# Altium schematic sheet Actuators.SchDoc: Actuators
size A3; SheetNumber: 6; SheetTotal: 10
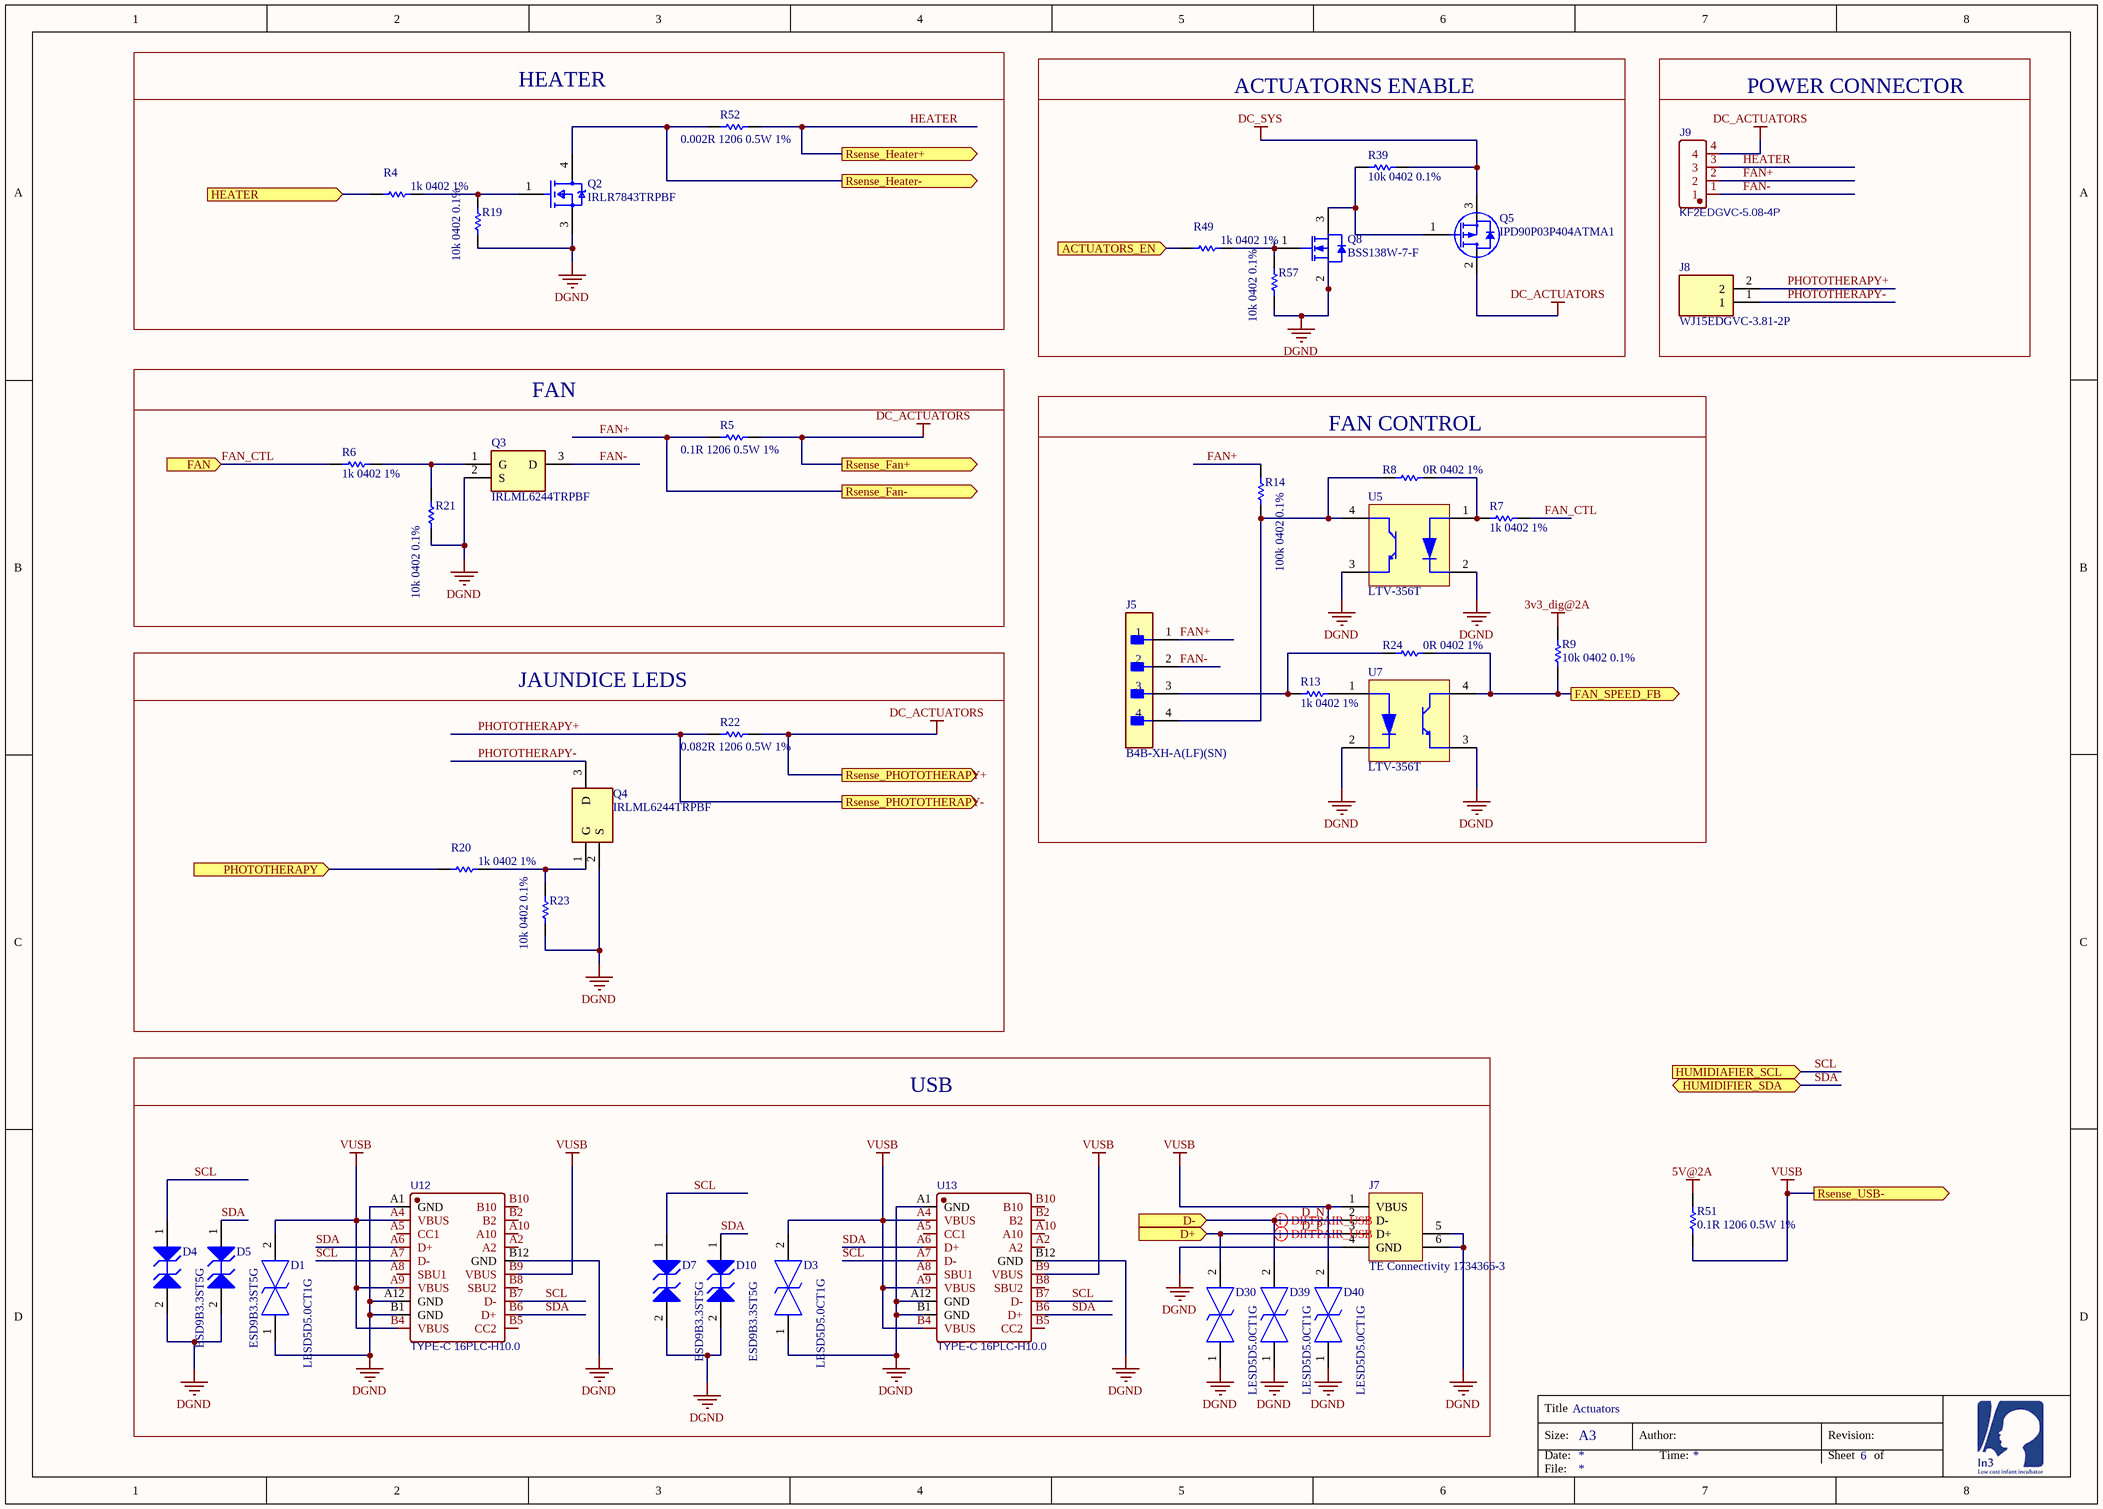
[diagram p0: Actuators.SchDoc]

## Parts
D1  LESD5D5.0CT1G  [LESD5D50CT1G]
D3  LESD5D5.0CT1G  [LESD5D50CT1G]
D4  ESD9B3.3ST5G  [ONSC-SOD-923-2-514AB-01_V]
D5  ESD9B3.3ST5G  [ONSC-SOD-923-2-514AB-01_V]
D7  ESD9B3.3ST5G  [ONSC-SOD-923-2-514AB-01_V]
D10  ESD9B3.3ST5G  [ONSC-SOD-923-2-514AB-01_V]
D30  LESD5D5.0CT1G  [LESD5D50CT1G]
D39  LESD5D5.0CT1G  [LESD5D50CT1G]
D40  LESD5D5.0CT1G  [LESD5D50CT1G]
J5  B4B-XH-A(LF)(SN)  [FP-B4B-XH-A_LF_SN-MFG]
J7  TE Connectivity 1734366-3  [PCB-wbedblczgi94a8su0lrn-1]
J8  WJ15EDGVC-3.81-2P  [SHDR2W85P0X381_1X2_850X700X935P]
J9  KF2EDGVC-5.08-4P  [CONN-TH_4P-P5.08_KF2EDGVC-5.08-4P]
Q2  IRLR7843TRPBF  [FP-PG-TO252-3-MFG]
Q3  IRLML6244TRPBF  [SOT95P237X112-3N]
Q4  IRLML6244TRPBF  [SOT95P237X112-3N]
Q5  IPD90P03P404ATMA1  [DPAK IPD90P03P404ATMA1]
Q8  BSS138W-7-F  [DIOD-SOT323-3_V]
R4  1k 0402 1%  [RESC1005X40X25ML05T10]
R5  0.1R 1206 0.5W 1%  [CAPC3216X180X55ML20T25]
R6  1k 0402 1%  [RESC1005X40X25ML05T10]
R7  1k 0402 1%  [RESC1005X40X25ML05T10]
R8  0R 0402 1%  [RESC1005X40X25ML05T10]
R9  10k 0402 0.1%  [RESC1005X40X25ML05T10]
R13  1k 0402 1%  [RESC1005X40X25ML05T10]
R14  100k 0402 0.1%  [RESC1005X40X25ML05T10]
R19  10k 0402 0.1%  [RESC1005X40X25ML05T10]
R20  1k 0402 1%  [RESC1005X40X25ML05T10]
R21  10k 0402 0.1%  [RESC1005X40X25ML05T10]
R22  0.082R 1206 0.5W 1%  [CAPC3216X180X55ML20T25]
R23  10k 0402 0.1%  [RESC1005X40X25ML05T10]
R24  0R 0402 1%  [RESC1005X40X25ML05T10]
R39  10k 0402 0.1%  [RESC1005X40X25ML05T10]
R49  1k 0402 1%  [RESC1005X40X25ML05T10]
R51  0.1R 1206 0.5W 1%  [CAPC3216X180X55ML20T25]
R52  0.002R 1206 0.5W 1%  [CAPC3216X180X55ML20T25]
R57  10k 0402 0.1%  [RESC1005X40X25ML05T10]
U5  LTV-356T  [LTST-LTV-356T-4_V]
U7  LTV-356T  [LTST-LTV-356T-4_V]
U12  TYPE-C 16PLC-H10.0  [TYPE-C-TH_16PLC-H10.0]
U13  TYPE-C 16PLC-H10.0  [TYPE-C-TH_16PLC-H10.0]

## Blocks framed on the sheet
HEATER: Q2 R4 R19 R52
ACTUATORNS ENABLE: Q5 Q8 R39 R49 R57
POWER CONNECTOR: J8 J9
FAN: Q3 R5 R6 R21
FAN CONTROL: J5 R7-R9 R13 R14 R24 U5 U7
JAUNDICE LEDS: Q4 R20 R22 R23
USB: D1 D3-D5 D7 D10 D30 D39 D40 J7 U12 U13

## Ports
ACTUATORS_EN (in), D+ (in), D- (in), FAN (in), FAN_SPEED_FB (out), HEATER (in), HUMIDIAFIER_SCL (in), HUMIDIFIER_SDA (bidir), PHOTOTHERAPY (in), Rsense_Fan+ (out), Rsense_Fan- (out), Rsense_Heater+ (out), Rsense_Heater- (out), Rsense_PHOTOTHERAPY+ (out), Rsense_PHOTOTHERAPY- (out), Rsense_USB- (out)

## Nets
3v3_dig@2A: R9.2
5V@2A: R51.1
DC_ACTUATORS: J9.4 Q5.2(D) R5.1 R22.1 ; port Rsense_PHOTOTHERAPY+, port Rsense_Fan+
DC_SYS: Q5.3(S) R39.1
DGND: D1.1 D3.1 D4.2(A2) D5.2(A2) D7.2(A2) D10.2(A2) D30.1 D39.1 D40.1 J7.4(GND) J7.5(SHIELD) J7.6(SHIELD) Q2.3(SOURCE) Q3.2(S) Q4.2(S) Q8.2(S) R19.1 R21.1 R23.1 R57.1 U5.2(CATHODE) U5.3(EMITTER) U7.2(CATHODE) U7.3(EMITTER) U12.A1(GND) U12.A12(GND) U12.B1(GND) U12.B12(GND) U13.A1(GND) U13.A12(GND) U13.B1(GND) U13.B12(GND)
VUSB: D1.2 D3.2 D40.2 J7.1(VBUS) R51.2 U12.A4(VBUS) U12.A9(VBUS) U12.B4(VBUS) U12.B9(VBUS) U13.A4(VBUS) U13.A9(VBUS) U13.B4(VBUS) U13.B9(VBUS) ; port Rsense_USB-
ACTUATORS_EN: R49.2 ; port ACTUATORS_EN
D_N: D39.2 J7.2(D-) ; port D-
D_P: D30.2 J7.3(D+) ; port D+
FAN+: J5.1 J9.2 R5.2 R14.2 ; port Rsense_Fan-
FAN-: J5.2 J9.1 Q3.3(D)
FAN_CTL: R6.2 R7.2 ; port FAN
FAN_SPEED_FB: R9.1 R24.1 U7.4(COLLECTOR) ; port FAN_SPEED_FB
HEATER: J9.3 R52.1 ; port Rsense_Heater+
HEATER: R4.2 ; port HEATER  [a separate net that carries the same name]
PHOTOTHERAPY: R20.2 ; port PHOTOTHERAPY
PHOTOTHERAPY+: J8.2 R22.2 ; port Rsense_PHOTOTHERAPY-
PHOTOTHERAPY-: J8.1 Q4.3(D)
Rsense_Heater-: Q2.4(DRAIN) R52.2 ; port Rsense_Heater-
SCL: D4.1(A1) D7.1(A1) U12.A7(D-) U12.B7(D-) U13.A7(D-) U13.B7(D-) ; port HUMIDIAFIER_SCL
SDA: D5.1(A1) D10.1(A1) U12.A6(D+) U12.B6(D+) U13.A6(D+) U13.B6(D+) ; port HUMIDIFIER_SDA
NetJ5_3: J5.3 R13.1 R24.2
NetJ5_4: J5.4 R8.2 R14.1 U5.4(COLLECTOR)
NetQ2_1: Q2.1(GATE) R4.1 R19.2
NetQ3_1: Q3.1(G) R6.1 R21.2
NetQ4_1: Q4.1(G) R20.1 R23.2
NetQ5_1: Q5.1(G) Q8.3(D) R39.2
NetQ8_1: Q8.1(G) R49.1 R57.2
NetR7_1: R7.1 R8.1 U5.1(ANODE)
NetR13_2: R13.2 U7.1(ANODE)

Not connected (* = marked no-connect by the designer): U12 A2 A5(CC1) A8(SBU1) A10 B2 B5(CC2) B8(SBU2) B10; U13 A2 A5(CC1) A8(SBU1) A10 B2 B5(CC2) B8(SBU2) B10

## Layout directives
differential pair; differential pair class USB: D_N, D_P

## Notes on the sheet
- Title
- Size:
- Date:
- A3
- Author:
- Time:
- Revision:
- Sheet
- of
- File:

## Library data of the parts
D1 D3 D30 D39 D40 = LESD5D5.0CT1G: TVS Diode (Bi-directional); Manufacturer_Name: LRC; Height: 0.7mm; Manufacturer_Part_Number: LESD5D5.0CT1G; LCSC_PN: C383211
D4 D5 D7 D10 = CMP-1063-00120-1: Transient Voltage Suppressor, Micro-Packaged Diode for ESD Protection, 2-Pin SOD-923, Pb-Free, Tape and Reel; Manufacturer: On Semiconductor; Number of Lines: 1; V(BR) Min (V): 5; VRWM Max (V): 3.3; Direction: Bidirectional; ComponentLink3URL: http://www.onsemi.com/pub_link/Collateral/514AB.PDF; PartNumber: ESD9B3.3ST5G; PackageVersion: Rev. C, 03/2011; Mounting Technology: Surface Mount; PackageReference: SOD-923-2-514AB-01; RoHS: Pb-Free; DatasheetVersion: Rev. 2; ComponentLink1URL: http://www.onsemi.com/; PackageDescription: 2-Pin SOD, Body 0.8 x 0.6 mm; ComponentLink3Description: Package Specification; ComponentLink2URL: http://www.onsemi.cn/pub_link/Collateral/ESD9B-D.PDF; IR Max (uA): 1; Packing: Tape and Reel; ComponentLink2Description: Datasheet; ComponentLink1Description: Manufacturer URL; LCSC_PN: C96512
J5 = CMP-17439-000250-1: CONN HEADER VERT 4POS 2.5MM; Number of Contacts: 4; Contact Resistance: 20mR; Voltage Rating: 250V; Max Current Rating: 3A; Gender: Male; Wire/Cable Gauge: 22AWG; Mated Stacking Heights: 9.8mm; Insulation Resistance: 1GR; Orientation: Straight; Contact Type: Male Pin; Contact Finish - Mating: TIN; Series: XH; Max Voltage Rating (AC): 250V; Lead Pitch: 2.5mm; Contact Shape: Square; Insulation Color: Natural; Termination: Solder; Lead Free: Lead Free; Voltage Rating (AC): 250V; Number of Rows: 1; Flammability Rating: UL94 V-0; Number of Positions: 4; Max Operating Temperature: 85°C; Package Quantity: 500; Mount: Through Hole; REACH SVHC: No SVHC; Connector Type: Header; Insulation Material: Nylon; Fastening Type: Detent; Min Operating Temperature: -25°C; Housing Color: White; Packaging: Bulk; Contact Plating: Tin; Contact Material: Brass; Max Voltage Rating (DC): 250V; Housing Material: Polyamide; Color: Natural; Material: Polyamide; Pitch: 2.5mm; Depth: 5.75mm; Current Rating: 3A; Length: 12.4mm; LCSC_PN: C144395
J7 = CMP-27c8ec666f97f80f-1: Conn USB 2.0 Type A RCP 4 POS Solder ST Thru-Hole 4 Terminal 1 Port Tray; Gender: Female; Lead-Free Status: Lead Free; ELV Compliant: Compliant; Housing Color: Blue; Octopart URL: http://octopart.com/1734366-3-te+connectivity-44330297; Manufacturer Part Number: 1734366-3; Packaging: Tray; Lifecycle Status: Active; RoHS: Compliant; Housing Material: Thermoplastic; Contact Plating: Gold Flash, Gold Flash over Nickel; OctopartID: 27c8ec666f97f80f; LCSC Part: C32896; LCSC_PN: C32896
J8 = WJ15EDGVC-3.81-2P: Connector; Manufacturer_Name: Ningbo Kangnex; Datasheet Link: https://datasheet.lcsc.com/szlcsc/Ningbo-Kangnex-Elec-WJ15EDGVC-3-81-2P_C8396.pdf; Height: 9.35mm; Manufacturer_Part_Number: WJ15EDGVC-3.81-2P; LCSC_PN: C8396
J9 = KF2EDGVC-5.08-4P: BOM_Manufacturer: Cixi Kefa Elec; Contributor: LCSC; BOM_Supplier: LCSC; BOM_Supplier Part: C441388; BOM_Manufacturer Part: KF2EDGVC-5.08-4P; BOM_JLCPCB Part Class: Extended Part; spicePre: C; spiceSymbolName: KF2EDGVC-5.08-4P; LCSC_PN: C441388
Q2 = CMP-32901-000143-1: MOSFET N-CH 30V 161A DPAK; Manufacturer: Infineon; Drain To Source Resistance: 3.2mΩ; Depletion Mode: False; Reverse Recovery Time: 39ns; Reverse Recovery Charge: 36nC; Threshold Vgs Max: 2.3V; Rthja Max: 50°C/W; Threshold Vgs Min: 1.4V; Power Dissipation: 140W; Pulse Drain Current: 620A; Input Capacitace At Vds: 4380pF @ 15V; Turn On Delay Time: 25ns; Gate To Source Voltage: 20V; Max Forward Diode Voltage: 1V; Gate Charge At Vgs: 34nC @ 4.5V; Max Junction Temp: +175°C; Number Of Channels: 1; Turn Off Delay Time: 34ns; ComponentLink2URL: https://www.infineon.com/dgdl/irlr7843pbf.pdf?fileId=5546d462533600a40153566de53526d8; Temperature Range High: +175°C; Octopart: https://octopart.com/irlr7843trpbf-infineon-65875062; Temperature: -55°C to +175°C; Device Class L3: MOSFETs; Manufacturer Part Number: IRLR7843TRPBF; Category: Trans; Package: PG-TO252-3; Footprint Url: https://www.infineon.com/cms/en/product/packages/PG-TO252/PG-TO252-3-901/; Continuous Drain Current: 161A; Digikey Description: MOSFET N-CH 30V 161A DPAK; Automotive: No; Lead Free: Yes; Drain To Source Breakdown Voltage: 30V; Height: 2.52mm; Temperature Range Low: -55°C; RoHS: TRUE; Number Of N Channels: 1; Drain To Source Voltage: 30V; ComponentLink2Description: Datasheet; Device Class L2: Transistors; Device Class L1: Discrete Semiconductors; LCSC_PN: C21988
Q3 Q4 = IRLML6244TRPBF: Transistor; Manufacturer_Name: Infineon; Datasheet Link: http://www.infineon.com/dgdl/irlml6244pbf.pdf?fileId=5546d462533600a4015356686fed261f; Height: 1.12mm; Manufacturer_Part_Number: IRLML6244TRPBF; Mouser Part Number: 942-IRLML6244TRPBF; Mouser Price/Stock: https://www.mouser.co.uk/ProductDetail/Infineon-IR/IRLML6244TRPBF?qs=9%252BKlkBgLFf1HkY%2F2U%252BIhLQ%3D%3D; Arrow Part Number: IRLML6244TRPBF; Arrow Price/Stock: https://www.arrow.com/en/products/irlml6244trpbf/infineon-technologies-ag?region=nac; LCSC_PN: C143946
Q5 = CMP-3103264-6: Single P-Channel 30 V 4.5 mOhm 100 nC OptiMOS Power Mosfet - TO-252-3-11; Lead-Free Status: Lead Free; REACH SVHC Compliance: No SVHC; Octopart URL: https://octopart.com/ipd90p03p404atma1-infineon-21386769; Polarity: P-Channel; RoHS: Compliant; Mounting Style: Surface Mount; Operating Temperature: 175 °C (max); Packaging: Reel; Number of Pins: 3; OctopartID: f6ad3ee185da296a; Manufacturer Part Number: IPD90P03P404ATMA1; Manufacturer Part Number 2: WSF70P03; LCSC_PN: C148439
Q8 = CMP-2000-05968-1: N-Channel Enhancement Mode Mosfet, 50 V, 200 mA, -55 to 150 degC, 6-Pin SOT-323, RoHS, Tape and Reel; Typical Turn-Off Delay Time: 20ns; Number of Channels: 1Channel; Type: EnhancementModeFieldEffectTransistor; Brand: DiodesIncorporated; Vds - Drain-Source Breakdown Voltage: 75V; Vgs - Gate-Source Voltage: 20V; Rds On - Drain-Source Resistance: 1.4Ohms; Transistor Type: 1N-Channel; Configuration: Single; Unit Weight: 0.000212oz; Pd - Power Dissipation: 200mW; Id - Continuous Drain Current: 200mA; Forward Transconductance - Min: 0.1S; Manufacturer URL: http://www.diodes.com/; Series: BSS138; Package Description: 3-Pin Small Outline Transistor, Body 2 x 1.25 mm, Pitch 0.65 mm; Mounting Technology: SurfaceMount; Product Category: MOSFET; RoHS: True; Maximum Operating Temperature: +150C; Height: 1mm; Length: 2.2mm; Technology: Si; Width: 1.35mm; Datasheet URL: http://www.diodes.com/_files/datasheets/ds30206.pdf; Manufacturer: DiodesIncorporated; Package / Case: SOT-323-3; Typical Turn-On Delay Time: 20ns; Transistor Polarity: N-Channel; Factory Pack Quantity: 3000; Packaging: Reel; Product: MOSFETSmallSignal; Datasheet Version: Rev. 11-2, 09/2013; Package Reference: SOT323; Minimum Operating Temperature: -55C; Mounting Style: SMD/SMT; Channel Mode: Enhancement; LCSC_PN: C24553
R4 R6-R9 R13 R14 R19-R21 R23 R24 R39 R49 R57 = CMP-2002-07472-1
  R4 R6 R7 R13 R20 R49: LCSC_PN: C106235
  R8 R24: LCSC_PN: C60485
  R9 R19 R21 R23 R39 R57: LCSC_PN: C190095
  R14: LCSC_PN: C60491
R5 R22 R51 = CMP-0abdc173b10ad57a-1: Manufacturer Part Number: WSLP12065L000FEA; Resistance: 0,1; Power: 1W; Octopart URL: https://octopart.com/1-2176055-0-te+connectivity-46440145; Case/Package: 1206; Lifecycle Status: Not Listed by Manufacturer; Packaging: Tape & Reel (TR); OctopartID: 0abdc173b10ad57a
  R5 R51: LCSC_PN: C601090
  R22: LCSC_PN: C705560
R52 = CMP-0abdc173b10ad57a-1: Manufacturer Part Number: WSLP12065L000FEA; Resistance: 0,002; Power: 1W; Octopart URL: https://octopart.com/1-2176055-0-te+connectivity-46440145; Case/Package: 1206; Lifecycle Status: Not Listed by Manufacturer; Packaging: Tape & Reel (TR); OctopartID: 0abdc173b10ad57a; OrderingCode: WSLP12065L000FEA; Manufacturer Part Number 2: FMF06FTHR005-LHL; LCSC_PN: C601094
U5 U7 = CMP-2000-05202-1: Optocoupler DC-IN 1-CH Transistor DC-OUT 4-Pin Mini-Flat; Manufacturer: Lite-On; Maximum Collector Current: 50mA; Maximum Collector Emitter Saturation Voltage: 200mV; Product Length: 3.6mm; Number of Channels per Chip: 1; Output Type: DC; Maximum Power Dissipation: 170mW; Minimum Isolation Voltage: 3750Vrms; Pin_Count: 4; Product Width: 4.4mm; Maximum Collector Emitter Voltage: 80V; Maximum Current Transfer Ratio: 600%; Typical Forward Voltage: 1.2V; Product Height: 2mm; Maximum Reverse Voltage: 6V; Typical Rise Time: 4us; Maximum Forward Voltage: 1.4V; Typical Fall Time: 3us; Minimum Current Transfer Ratio: 50%; Maximum Fall Time: 18us; Datasheet Version: May-09; Family: LTV-356T; Product Type: TransistorandPhotovoltaicOutputPhotoCouplers; Manufacturer URL: http://www.us.liteon.com/; Output Device: Transistor; Input Type: DC; Mounting: SurfaceMount; Maximum Input Current: 50mA; Minimum Operating Temperature: -55C; Supplier_Package: (Min)i-Flat; Datasheet URL: https://datasheet.ciiva.com/16216/ltv-356t-16216247.pdf; Maximum Operating Temperature: 100C; Maximum Rise Time: 18us; LCSC_PN: C125117
U12 U13 = TYPE-C 16PLC-H10.0: Manufacturer: SHOU HAN(首韩); Contributor: lcsc; Supplier: LCSC; Supplier Part: C3151747; Manufacturer Part: TYPE-C 16PLC-H10.0; JLCPCB Part Class: Extended Part; spicePre: U; spiceSymbolName: TYPE-C 16PLC-H10.0; LCSC_PN: C3151747